# Altium project hand_main_v2.PrjPcb (part 1 of 2)
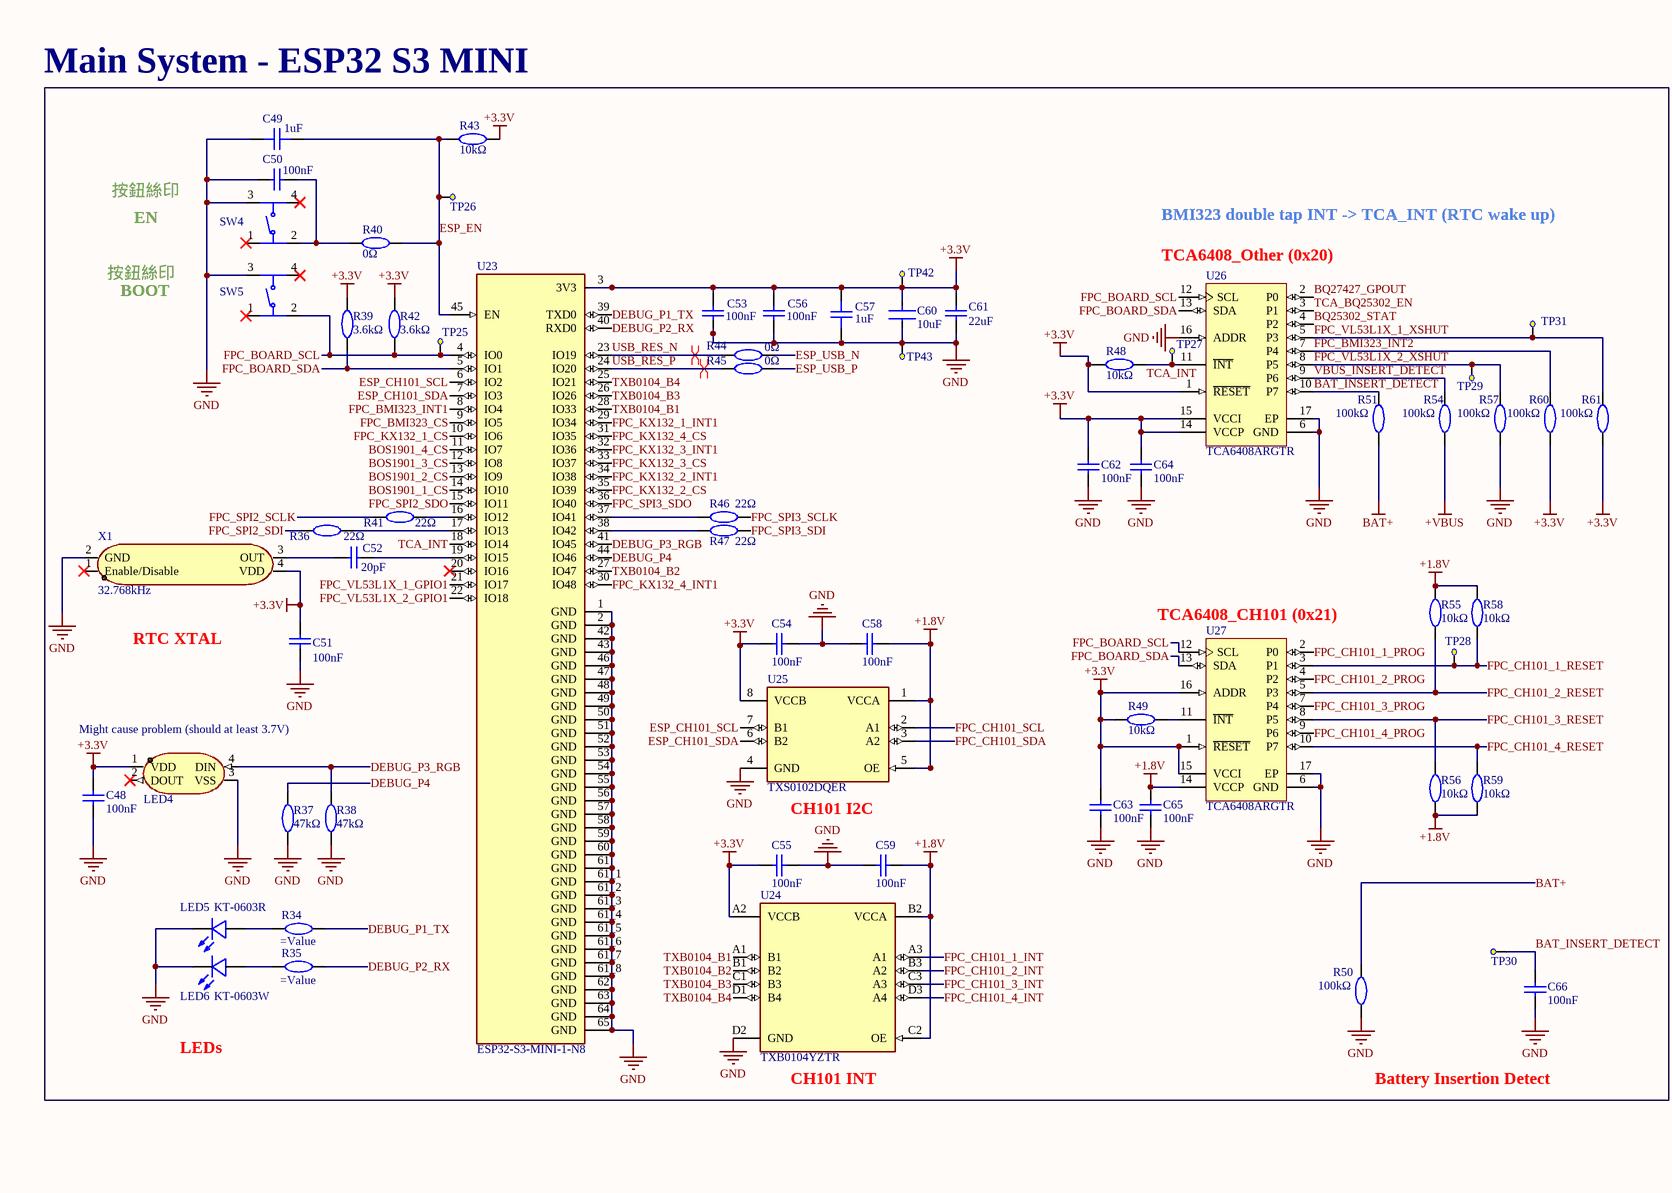
[diagram p0: hand_main_v2.SchDoc, left]
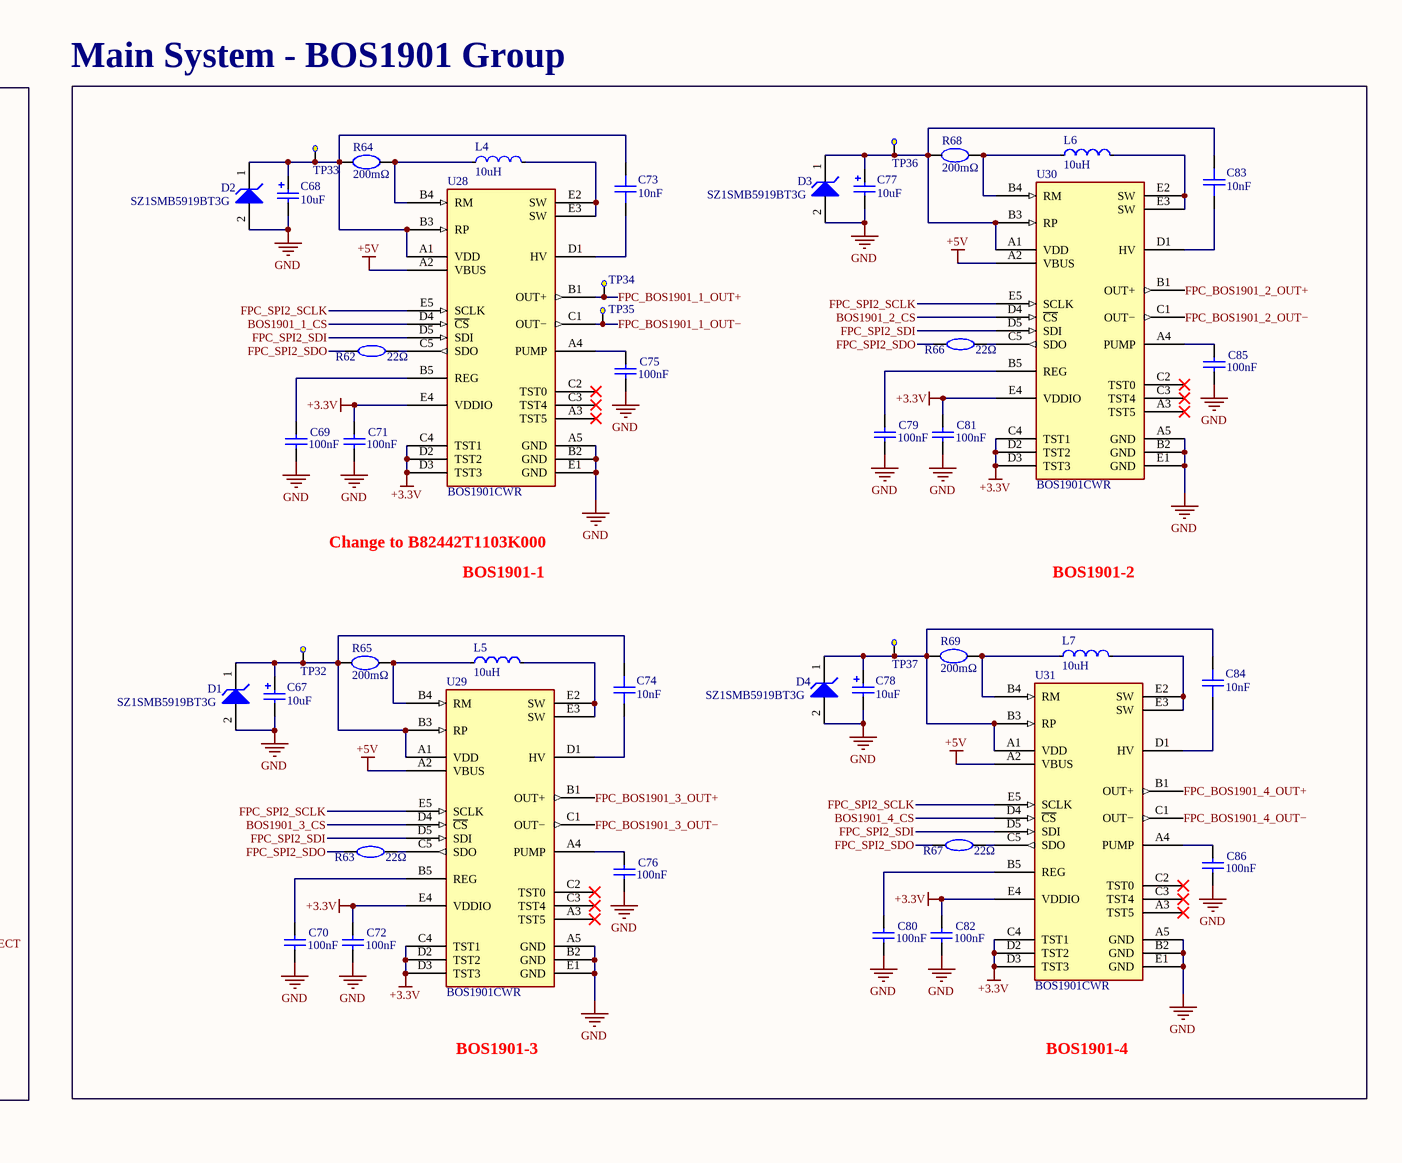
[diagram p1: hand_main_v2.SchDoc, middle]
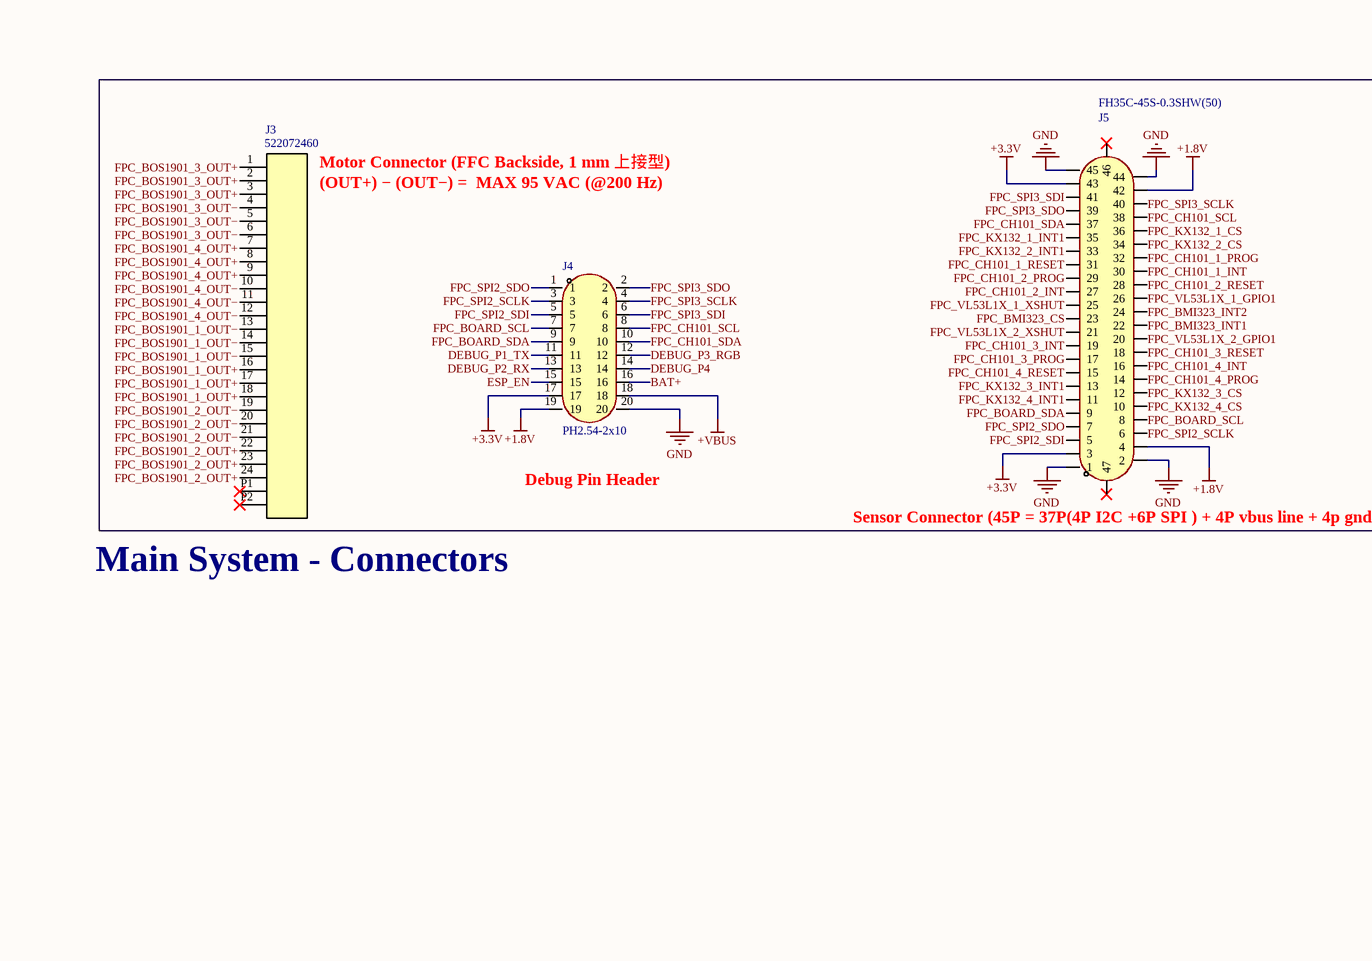
[diagram p2: hand_main_v2.SchDoc, right]
2 sheets, 213 parts. Net scope: global (net labels, ports and power ports of the same name join across sheets).
Board file: hand_main_board_v2.PcbDoc
Sheets:
  hand_main_v2.SchDoc
  hand_pdn_v2.SchDoc

## Sheet hand_main_v2.SchDoc
size 889 x 279 mm; SheetNumber: 1; SheetTotal: 2; SPICEModelCacheDEHSZJPB: <root> / <DocumentId>DEHSZJPB</DocumentId> / </root>

### Parts
C48  100nF  [CAPC1050X55X23NL05T13]
C49  1uF  [C0402]
C50  100nF  [CAPC1050X55X23NL05T13]
C51  100nF  [CAPC1050X55X23NL05T13]
C52  20pF  [C0603]
C53  100nF  [CAPC1050X55X23NL05T13]
C54  100nF  [CAPC1050X55X23NL05T13]
C55  100nF  [CAPC1050X55X23NL05T13]
C56  100nF  [CAPC1050X55X23NL05T13]
C57  1uF  [C0402]
C58  100nF  [CAPC1050X55X23NL05T13]
C59  100nF  [CAPC1050X55X23NL05T13]
C60  10uF  [FP-CL10-IPC_A]
C61  22uF  [CAPC2013X140X45ML15T25]
C62  100nF  [CAPC1050X55X23NL05T13]
C63  100nF  [CAPC1050X55X23NL05T13]
C64  100nF  [CAPC1050X55X23NL05T13]
C65  100nF  [CAPC1050X55X23NL05T13]
C66  100nF  [CAPC1050X55X23NL05T13]
C67  10uF  [CAP-SMD_L3.2-W1.6-RD-C7171]
C68  10uF  [CAP-SMD_L3.2-W1.6-RD-C7171]
C69  100nF  [CAPC1050X55X23NL05T13]
C70  100nF  [CAPC1050X55X23NL05T13]
C71  100nF  [CAPC1050X55X23NL05T13]
C72  100nF  [CAPC1050X55X23NL05T13]
C73  10nF  [C1206]
C74  10nF  [C1206]
C75  100nF  [CAPC1050X55X23NL05T13]
C76  100nF  [CAPC1050X55X23NL05T13]
C77  10uF  [CAP-SMD_L3.2-W1.6-RD-C7171]
C78  10uF  [CAP-SMD_L3.2-W1.6-RD-C7171]
C79  100nF  [CAPC1050X55X23NL05T13]
C80  100nF  [CAPC1050X55X23NL05T13]
C81  100nF  [CAPC1050X55X23NL05T13]
C82  100nF  [CAPC1050X55X23NL05T13]
C83  10nF  [C1206]
C84  10nF  [C1206]
C85  100nF  [CAPC1050X55X23NL05T13]
C86  100nF  [CAPC1050X55X23NL05T13]
D1  SZ1SMB5919BT3G  [ONSC-SMB-2-403A-03_H_V]
D2  SZ1SMB5919BT3G  [ONSC-SMB-2-403A-03_H_V]
D3  SZ1SMB5919BT3G  [ONSC-SMB-2-403A-03_H_V]
D4  SZ1SMB5919BT3G  [ONSC-SMB-2-403A-03_H_V]
J3  522072460  [CON_522072460_MOL]
J4  PH2.54-2x10  [HDR-TH_20P-P2.54-V-M-R2-C10-S2.54]
J5  FH35C-45S-0.3SHW(50)  [FPC-SMD_FH35C-45S-0.3SHW-50]
L4  10uH  [IND-SMD_L7.8-W7.0-A]
L5  10uH  [IND-SMD_L7.8-W7.0-A]
L6  10uH  [IND-SMD_L7.8-W7.0-A]
L7  10uH  [IND-SMD_L7.8-W7.0-A]
LED4  WS2812B-MINI-V3/W  [LED-SMD_4P-L3.5-W3.5-TL_WS2812B]  (value not drawn)
LED5  KT-0603R  [LED0603-RD]
LED6  KT-0603W  [LED0603-R-RD_WHITE]
R34  (no value)  [R0402]
R35  (no value)  [R0402]
R36  22Ω  [R0402]
R37  47kΩ  [R0402]
R38  47kΩ  [R0402]
R39  3.6kΩ  [R0603]
R40  0Ω  [R0402]
R41  22Ω  [R0402]
R42  3.6kΩ  [R0603]
R43  10kΩ  [R0402]
R44  0Ω  [R0402]
R45  0Ω  [R0402]
R46  22Ω  [R0402]
R47  22Ω  [R0402]
R48  10kΩ  [R0402]
R49  10kΩ  [R0402]
R50  100kΩ  [R0402]
R51  100kΩ  [R0402]
R54  100kΩ  [R0402]
R55  10kΩ  [R0402]
R56  10kΩ  [R0402]
R57  100kΩ  [R0402]
R58  10kΩ  [R0402]
R59  10kΩ  [R0402]
R60  100kΩ  [R0402]
R61  100kΩ  [R0402]
R62  22Ω  [R0402]
R63  22Ω  [R0402]
R64  200mΩ  [R1206]
R65  200mΩ  [R1206]
R66  22Ω  [R0402]
R67  22Ω  [R0402]
R68  200mΩ  [R1206]
R69  200mΩ  [R1206]
SW4  TS-1187A-B-A-B  [SW-SMD_4P-L5.1-W5.1-P3.70-LS6.5-TL-2]  (value not drawn)
SW5  TS-1187A-B-A-B  [SW-SMD_4P-L5.1-W5.1-P3.70-LS6.5-TL-2]  (value not drawn)
TP25  Test point  [Test_Point]  (value not drawn)
TP26  Test point  [Test_Point]  (value not drawn)
TP27  Test point  [Test_Point]  (value not drawn)
TP28  Test point  [Test_Point]  (value not drawn)
TP29  Test point  [Test_Point]  (value not drawn)
TP30  Test point  [Test_Point]  (value not drawn)
TP31  Test point  [Test_Point]  (value not drawn)
TP32  Test point  [Test_Point]  (value not drawn)
TP33  Test point  [Test_Point]  (value not drawn)
TP34  Test point  [Test_Point]  (value not drawn)
TP35  Test point  [Test_Point]  (value not drawn)
TP36  Test point  [Test_Point]  (value not drawn)
TP37  Test point  [Test_Point]  (value not drawn)
TP42  Test point  [Test_Point]  (value not drawn)
TP43  Test point  [Test_Point]  (value not drawn)
U23  ESP32-S3-MINI-1-N8  [XCVR_ESP32-S3-MINI-1-N8]
U24  TXB0104YZTR  [FP-YZT0012-IPC_B]
U25  TXS0102DQER  [FP-DQE0008A-IPC_C]
U26  TCA6408ARGTR  [RGT0016A_V]
U27  TCA6408ARGTR  [RGT0016A_V]
U28  BOS1901CWR  [BOS1901_BGA25C40P5X5_212X224X66]
U29  BOS1901CWR  [BOS1901_BGA25C40P5X5_212X224X66]
U30  BOS1901CWR  [BOS1901_BGA25C40P5X5_212X224X66]
U31  BOS1901CWR  [BOS1901_BGA25C40P5X5_212X224X66]
X1  32.768kHz  [OSC-SMD_4P-L2.5-W2.0-BL]

### Blocks framed on the sheet
Main System - ESP32 S3 MINI: C48-C66 LED4-LED6 R34-R51 R54-R61 SW4 SW5 TP25-TP31 TP42 TP43 U23-U27 X1
Main System - BOS1901 Group: C67-C86 D1-D4 L4-L7 R62-R69 TP32-TP37 U28-U31

### Nets
+1.8V: C58.1 C59.1 C65.1 J4.19 J5.4 J5.42 R55.1 R56.2 R58.1 R59.2 U24.B2(VCCA) U24.C2(OE) U25.1(VCCA) U25.5(OE) U27.14(VCCP)
+3.3V: C48.2 C51.2 C53.2 C54.2 C55.2 C56.2 C57.2 C60.1 C61.2 C62.1 C63.1 C64.1 C71.2 C72.2 C81.2 C82.2 J4.17 J5.3 J5.43 LED4.1(VDD) R39.2 R42.2 R43.1 R48.2 R49.2 R60.1 R61.1 TP42.TP?(Test_point) U23.3(3V3) U24.A2(VCCB) U25.8(VCCB) U26.1(~{RESET}) U26.14(VCCP) U26.15(VCCI) U27.1(~{RESET}) U27.15(VCCI) U27.16(ADDR) U28.C4(TST1) U28.D2(TST2) U28.D3(TST3) U28.E4(VDDIO) U29.C4(TST1) U29.D2(TST2) U29.D3(TST3) U29.E4(VDDIO) U30.C4(TST1) U30.D2(TST2) U30.D3(TST3) U30.E4(VDDIO) U31.C4(TST1) U31.D2(TST2) U31.D3(TST3) U31.E4(VDDIO) X1.4(VDD)
+5V: U28.A2(VBUS) U29.A2(VBUS) U30.A2(VBUS) U31.A2(VBUS)
+VBUS: J4.18 R54.1
BAT+: J4.16 R50.2 R51.1
GND: C48.1 C49.2 C50.2 C51.1 C53.1 C54.1 C55.1 C56.1 C57.1 C58.2 C59.2 C60.2 C61.1 C62.2 C63.2 C64.2 C65.2 C66.1 C67.2 C68.2 C69.1 C70.1 C71.1 C72.1 C75.1 C76.1 C77.2 C78.2 C79.1 C80.1 C81.1 C82.1 C85.1 C86.1 D1.2(A) D2.2(A) D3.2(A) D4.2(A) J4.20 J5.1 J5.2 J5.44 J5.45 LED4.3(VSS) LED5.1(K) LED6.2(K) R37.1 R38.1 R50.1 R57.1 SW4.3(C) SW5.3(C) TP43.TP?(Test_point) U23.1(GND) U23.2(GND) U23.42(GND) U23.43(GND) U23.46(GND) U23.47(GND) U23.48(GND) U23.49(GND) U23.50(GND) U23.51(GND) U23.52(GND) U23.53(GND) U23.54(GND) U23.55(GND) U23.56(GND) U23.57(GND) U23.58(GND) U23.59(GND) U23.60(GND) U23.61(GND) U23.61_1(GND) U23.61_2(GND) U23.61_3(GND) U23.61_4(GND) U23.61_5(GND) U23.61_6(GND) U23.61_7(GND) U23.61_8(GND) U23.62(GND) U23.63(GND) U23.64(GND) U23.65(GND) U24.D2(GND) U25.4(GND) U26.6(GND) U26.16(ADDR) U26.17(EP) U27.6(GND) U27.17(EP) U28.A5(GND) U28.B2(GND) U28.E1(GND) U29.A5(GND) U29.B2(GND) U29.E1(GND) U30.A5(GND) U30.B2(GND) U30.E1(GND) U31.A5(GND) U31.B2(GND) U31.E1(GND) X1.2(GND)
BAT_INSERT_DETECT: C66.2 R51.2 TP30.TP?(Test_point) U26.10(P7)
BOS1901_1_CS: U23.14(IO10) U28.D4(~{CS})
BOS1901_2_CS: U23.13(IO9) U30.D4(~{CS})
BOS1901_3_CS: U23.12(IO8) U29.D4(~{CS})
BOS1901_4_CS: U23.11(IO7) U31.D4(~{CS})
BQ25302_STAT: U26.4(P2)
BQ27427_GPOUT: U26.2(P0)
DEBUG_P1_TX: J4.11 R34.1 U23.39(TXD0)
DEBUG_P2_RX: J4.13 R35.1 U23.40(RXD0)
DEBUG_P3_RGB: J4.12 LED4.4(DIN) R38.2 U23.41(IO45)
DEBUG_P4: J4.14 R37.2 U23.44(IO46)
ESP_CH101_SCL: U23.6(IO2) U25.7(B1)
ESP_CH101_SDA: U23.7(IO3) U25.6(B2)
ESP_EN: C49.1 J4.15 R40.2 R43.2 TP26.TP?(Test_point) U23.45(EN)
ESP_USB_N: R44.2
ESP_USB_P: R45.2
FPC_BMI323_CS: J5.23 U23.9(IO5)
FPC_BMI323_INT1: J5.22 U23.8(IO4)
FPC_BMI323_INT2: J5.24 R60.2 U26.7(P4)
FPC_BOARD_SCL: J4.7 J5.8 R42.1 SW5.2(B) TP25.TP?(Test_point) U23.4(IO0) U26.12(SCL) U27.12(SCL)
FPC_BOARD_SDA: J4.9 J5.9 R39.1 U23.5(IO1) U26.13(SDA) U27.13(SDA)
FPC_BOS1901_1_OUT+: J3.16 J3.17 J3.18 TP34.TP?(Test_point) U28.B1(OUT+)
FPC_BOS1901_1_OUT−: J3.13 J3.14 J3.15 TP35.TP?(Test_point) U28.C1(OUT−)
FPC_BOS1901_2_OUT+: J3.22 J3.23 J3.24 U30.B1(OUT+)
FPC_BOS1901_2_OUT−: J3.19 J3.20 J3.21 U30.C1(OUT−)
FPC_BOS1901_3_OUT+: J3.1 J3.2 J3.3 U29.B1(OUT+)
FPC_BOS1901_3_OUT−: J3.4 J3.5 J3.6 U29.C1(OUT−)
FPC_BOS1901_4_OUT+: J3.7 J3.8 J3.9 U31.B1(OUT+)
FPC_BOS1901_4_OUT−: J3.10 J3.11 J3.12 U31.C1(OUT−)
FPC_CH101_1_INT: J5.30 U24.A3(A1)
FPC_CH101_1_PROG: J5.32 U27.2(P0)
FPC_CH101_1_RESET: J5.31 R58.2 TP28.TP?(Test_point) U27.3(P1)
FPC_CH101_2_INT: J5.27 U24.B3(A2)
FPC_CH101_2_PROG: J5.29 U27.4(P2)
FPC_CH101_2_RESET: J5.28 R55.2 U27.5(P3)
FPC_CH101_3_INT: J5.19 U24.C3(A3)
FPC_CH101_3_PROG: J5.17 U27.7(P4)
FPC_CH101_3_RESET: J5.18 R56.1 U27.8(P5)
FPC_CH101_4_INT: J5.16 U24.D3(A4)
FPC_CH101_4_PROG: J5.14 U27.9(P6)
FPC_CH101_4_RESET: J5.15 R59.1 U27.10(P7)
FPC_CH101_SCL: J4.8 J5.38 U25.2(A1)
FPC_CH101_SDA: J4.10 J5.37 U25.3(A2)
FPC_KX132_1_CS: J5.36 U23.10(IO6)
FPC_KX132_1_INT1: J5.35 U23.29(IO34)
FPC_KX132_2_CS: J5.34 U23.35(IO39)
FPC_KX132_2_INT1: J5.33 U23.34(IO38)
FPC_KX132_3_CS: J5.12 U23.33(IO37)
FPC_KX132_3_INT1: J5.13 U23.32(IO36)
FPC_KX132_4_CS: J5.10 U23.31(IO35)
FPC_KX132_4_INT1: J5.11 U23.30(IO48)
FPC_SPI2_SCLK: J4.3 J5.6 R41.1 U28.E5(SCLK) U29.E5(SCLK) U30.E5(SCLK) U31.E5(SCLK)
FPC_SPI2_SDI: J4.5 J5.5 R36.1 U28.D5(SDI) U29.D5(SDI) U30.D5(SDI) U31.D5(SDI)
FPC_SPI2_SDO: J4.1 J5.7 R62.1 R63.1 R66.1 R67.1 U23.15(IO11)
FPC_SPI3_SCLK: J4.4 J5.40 R46.2
FPC_SPI3_SDI: J4.6 J5.41 R47.2
FPC_SPI3_SDO: J4.2 J5.39 U23.36(IO40)
FPC_VL53L1X_1_GPIO1: J5.26 U23.21(IO17)
FPC_VL53L1X_1_XSHUT: J5.25 R61.2 TP31.TP?(Test_point) U26.5(P3)
FPC_VL53L1X_2_GPIO1: J5.20 U23.22(IO18)
FPC_VL53L1X_2_XSHUT: J5.21 R57.2 TP29.TP?(Test_point) U26.8(P5)
TCA_BQ25302_EN: U26.3(P1)
TCA_INT: R48.1 TP27.TP?(Test_point) U23.18(IO14) U26.11(~{INT})
TXB0104_B1: U23.28(IO33) U24.A1(B1)
TXB0104_B2: U23.27(IO47) U24.B1(B2)
TXB0104_B3: U23.26(IO26) U24.C1(B3)
TXB0104_B4: U23.25(IO21) U24.D1(B4)
USB_RES_N: R44.1 U23.23(IO19)
USB_RES_P: R45.1 U23.24(IO20)
VBUS_INSERT_DETECT: R54.2 U26.9(P6)
NetC50_1: C50.1 R40.1 SW4.2(B)
NetC52_1: C52.1 X1.3(OUT)
NetC52_2: C52.2 U23.19(IO15)
NetC67_1: C67.1 C74.2 D1.1(K) R65.1 TP32.TP?(Test_point) U29.A1(VDD) U29.B3(RP)
NetC68_1: C68.1 C73.2 D2.1(K) R64.1 TP33.TP?(Test_point) U28.A1(VDD) U28.B3(RP)
NetC69_2: C69.2 U28.B5(REG)
NetC70_2: C70.2 U29.B5(REG)
NetC73_1: C73.1 U28.D1(HV)
NetC74_1: C74.1 U29.D1(HV)
NetC75_2: C75.2 U28.A4(PUMP)
NetC76_2: C76.2 U29.A4(PUMP)
NetC77_1: C77.1 C83.2 D3.1(K) R68.1 TP36.TP?(Test_point) U30.A1(VDD) U30.B3(RP)
NetC78_1: C78.1 C84.2 D4.1(K) R69.1 TP37.TP?(Test_point) U31.A1(VDD) U31.B3(RP)
NetC79_2: C79.2 U30.B5(REG)
NetC80_2: C80.2 U31.B5(REG)
NetC83_1: C83.1 U30.D1(HV)
NetC84_1: C84.1 U31.D1(HV)
NetC85_2: C85.2 U30.A4(PUMP)
NetC86_2: C86.2 U31.A4(PUMP)
NetL4_1: L4.1 R64.2 U28.B4(RM)
NetL4_2: L4.2 U28.E2(SW) U28.E3(SW)
NetL5_1: L5.1 R65.2 U29.B4(RM)
NetL5_2: L5.2 U29.E2(SW) U29.E3(SW)
NetL6_1: L6.1 R68.2 U30.B4(RM)
NetL6_2: L6.2 U30.E2(SW) U30.E3(SW)
NetL7_1: L7.1 R69.2 U31.B4(RM)
NetL7_2: L7.2 U31.E2(SW) U31.E3(SW)
NetLED5_2: LED5.2(A) R34.2
NetLED6_1: LED6.1(A) R35.2
NetR36_2: R36.2 U23.17(IO13)
NetR41_2: R41.2 U23.16(IO12)
NetR46_1: R46.1 U23.37(IO41)
NetR47_1: R47.1 U23.38(IO42)
NetR49_1: R49.1 U27.11(~{INT})
NetR62_2: R62.2 U28.C5(SDO)
NetR63_2: R63.2 U29.C5(SDO)
NetR66_2: R66.2 U30.C5(SDO)
NetR67_2: R67.2 U31.C5(SDO)

Not connected (* = marked no-connect by the designer): J3 P1* P2*; J5 46* 47*; LED4 2(DOUT)*; SW4 1(A)* 4(D)*; SW5 1(A)* 4(D)*; U23 20(IO16)*; U28 A3(TST5)* C2(TST0)* C3(TST4)*; U29 A3(TST5)* C2(TST0)* C3(TST4)*; U30 A3(TST5)* C2(TST0)* C3(TST4)*; U31 A3(TST5)* C2(TST0)* C3(TST4)*; X1 1(Enable/Disable)*

### Layout directives
differential pair: USB_RES_N, USB_RES_P

### Notes on the sheet
- 按鈕絲印
- EN
- BMI323 double tap INT -> TCA_INT (RTC wake up)
- (near U26) TCA6408_Other (0x20)
- BOOT
- (near J3) Motor Connector (FFC Backside, 1 mm 上接型)
- (near J3) (OUT+) − (OUT−) =  MAX 95 VAC (@200 Hz)
- Change to B82442T1103K000
- (near U27) TCA6408_CH101 (0x21)
- BOS1901-1
- BOS1901-2
- RTC XTAL
- (near LED4) Might cause problem (should at least 3.7V)
- Debug Pin Header
- CH101 I2C
- (near J5) Sensor Connector (45P = 37P(4P I2C +6P SPI ) + 4P vbus line + 4p gnd)
- (near J3) Main System - Connectors
- LEDs
- (near U24) CH101 INT
- Battery Insertion Detect
- BOS1901-3
- BOS1901-4

### Library data of the parts
C48 C50 C51 C53-C56 C58 C59 C62-C66 C69-C72 C75 C76 C79-C82 C85 C86 = CL05B104KO5NNNC: Chip Capacitor, 100 nF, +/- 10%, 16 V, -55 to 125 degC, 0402 (1005 Metric), RoHS, Tape and Reel; Manufacturer: Samsung Electro-Mechanics; Capacitance: 100000pF; Dielectric: X7R; Rated Voltage: 16V; Case Size/Dimension: 0402; Tolerance (%): ±10%; Manufacturer URL: http://www.samsungsem.com/global/index.jsp; Datasheet URL: https://datasheet.ciiva.com/29198/458718-da-01-en-vs-kondensator-0402-29198423.pdf; Datasheet Version: Nov-10
C49 C57 = CL05A105KA5NQNC: MLCC, 1 uF, 25 V, ± 10%, X5R, 0402 [1005 Metric]; Manufacturer: SAMSUNG(三星); Add into BOM: yes; Voltage Rated: 25V; Symbol: CL05A105KA5NQNC; Device: CL05A105KA5NQNC; LCSC Part Name: 1uF ±10% 25V; Supplier Part: C52923; Manufacturer Part: CL05A105KA5NQNC; Supplier Footprint: 0402; JLCPCB Part Class: Basic Part; Datasheet: https://atta.szlcsc.com/upload/public/pdf/source/20160218/1457707763339.pdf; Supplier: LCSC; Convert to PCB: yes; Value: 1uF; Tolerance: ±10%; Temperature Coefficient: X5R; Name: 1uF
C52 = CL10C200JB8NNNC: MLCC, 20pF, 50 V, ± 5%, C0G, 0603 [1608 Metric]; Manufacturer: SAMSUNG(三星); Add into BOM: yes; Voltage Rated: 50V; Symbol: CL10C200JB8NNNC; Device: CL10C200JB8NNNC; LCSC Part Name: 20pF ±5% 50V; Supplier Part: C1648; Manufacturer Part: CL10C200JB8NNNC; Supplier Footprint: 0603; JLCPCB Part Class: Basic Part; Datasheet: https://atta.szlcsc.com/upload/public/pdf/source/20160218/1457707763339.pdf; Supplier: LCSC; Convert to PCB: yes; Value: 20pF; Tolerance: ±5%; Temperature Coefficient: C0G; Name: 20pF
C60 = CL10A106MA8NRNC: Cap Ceramic 10uF 25V X5R ±20% Pad SMD 0603 +85°C T/R; Width: 0.031inch; Voltage Rating: 25V; Length: 0.063inch; Case Code (Metric): 1608; Dielectric: X5R; Termination: Wraparound; Capacitance: 10uF; Lead Free: Lead Free; Mount: Surface Mount; Package Quantity: 1; Case Code (Imperial): 0603; Thickness: 0.035inch; Packaging: Tape and Reel; Contact Plating: Tin; Min Operating Temperature: -55°C; Tolerance: 20%; Max Operating Temperature: 85°C; Case/Package: 0603
C61 = CL21A226MAQNNNE: Multi-layer Ceramic Capacitor, 22 uF, -55 to 85 degC, 2-Pin SMD (0805), RoHS, Tape and Reel; Manufacturer: Samsung Electro-Mechanics; Voltage - Rated: 25V; Other Names: 1276-2908-2; Capacitance: 22µF; Featured Product: Multi-LayerCeramicCapacitors; Product Training Modules: HighCapMLCCFamily; Temperature Coefficient: X5R; Tolerance: ±20%; Online Catalog: CLSeries,HighCapacitance; Applications: GeneralPurpose; RoHS Information: MLCCRoHS2Compliance; Height - Seated (Max): -; Lead Style: -; Lead Spacing: -; Datasheet URL: http://datasheet.octopart.com/CL21A226MAQNNNE-Samsung-datasheet-48647558.pdf; Size / Dimension: 0.079"Lx0.049"W(2.00mmx1.25mm); Thickness (Max): 0.055"(1.40mm); Family: CeramicCapacitors; Package Description: 2-Pin Surface Mount Device, Body 2.0 x 1.25 mm; Datasheet Version: 07/2015; Packaging: Tape&Reel(TR); Manufacturer URL: http://www.samsungsem.com/global/index.jsp; Ratings: -; Package / Case: 0805(2012Metric); Standard Package: 2,000; Mounting Type: SurfaceMount,MLCC; Mounting Technology: SurfaceMount; Category: Capacitors; Package Reference: 0805; Series: CL; Features: -; Operating Temperature: -55°C~85°C
C67 C68 C77 C78 = TAJA106K016RNJ: 10 uF Tantalum Capacitor, Operating Temperature: -55°C to +125°C, ESR: 3Ω @ 100kHz, Tolerance: ±10%, Rated Voltage: 16V.; Manufacturer: Kyocera AVX; Add into BOM: yes; Rated Voltage: 16V; Symbol: TAJA106K016RNJ; Device: TAJA106K016RNJ; LCSC Part Name: 10uF ±10% 16V; Supplier Part: C7171; Manufacturer Part: TAJA106K016RNJ; Supplier Footprint: CASE-A-3216; JLCPCB Part Class: 基础库; Datasheet: https://atta.szlcsc.com/upload/public/pdf/source/20160107/1457707750344.pdf; Supplier: LCSC; Convert to PCB: yes; Value: 10uF; Tolerance: ±10%; Equivalent Series Resistance(ESR): 3Ω@100kHz; Operating Temperature: -55℃~+125℃; Name: 10uF
C73 C74 C83 C84 = GCM31B5C2E103JX01L: Cap Ceramic 0.01uF 250V C0G 5% SMD 1206 125°C Embossed T/R; Manufacturer: muRata(村田); Add into BOM: yes; Symbol: GCM31B5C2E103JX01L; Device: GCM31B5C2E103JX01L; LCSC Part Name: 10nF ±5% 250V; Supplier Part: C1021645; Manufacturer Part: GCM31B5C2E103JX01L; Supplier Footprint: 1206; JLCPCB Part Class: 扩展库; Datasheet: https://atta.szlcsc.com/upload/public/pdf/source/20200305/C490387_23319AE8C154DEB24C505E6C82A8106A.pdf; Supplier: LCSC; Convert to PCB: yes; Value: 10nF; Tolerance: ±5%; Voltage Rated: 250V; Temperature Coefficient: -; Name: 10nF
D1-D4 = SZ1SMB5919BT3G: 3 W Zener Voltage Regulator, 2-Pin SMB, Pb-Free, Tape and Reel; Manufacturer: On Semiconductor; VZ Typ (V): 5.6; RoHS: Pb-Free; ComponentLink1URL: http://www.onsemi.com/; PackageReference: SMB-2-403A-03_H; ComponentLink2Description: Datasheet; ComponentLink3Description: Package Specification; PackageDescription: 2-Pin Small Molded Package, J-Bend Lead, Body 4.33 x 3.625 mm; DatasheetVersion: Rev. 8; ComponentLink1Description: Manufacturer URL; PartNumber: SZ1SMB5919BT3G; ComponentLink3URL: http://www.onsemi.com/pub_link/Collateral/1SMB5913BT3-D.PDF; Packing: Tape and Reel; Mounting Technology: Surface Mount; ComponentLink2URL: http://www.onsemi.com/pub_link/Collateral/1SMB5913BT3-D.PDF; PackageVersion: Rev. H, 05/2011
J3 = 522072460: FFC 1mm 24P; Mfr_Name: Molex Connector Corporation; RefDes: RefDes; Type: Type
J4 = PH2.54-2x10: Pin Header 2.54mm, 2x10; Manufacturer: ZHOURI(洲日); Add into BOM: yes; Pin Structure: 2x10P; Symbol: PH2.54-2x10; Device: PH2.54-2x10; Supplier: LCSC; Supplier Part: C5116480; Manufacturer Part: PH2.54-2x10; JLCPCB Part Class: Extended Part; LCSC Part Name: PH2.54-2x10; Supplier Footprint: 插件,P=2.54mm; Datasheet: https://atta.szlcsc.com/upload/public/pdf/source/20220412/C6BEA3D643D1CE07163CD717B50927E0.pdf; Convert to PCB: yes; Pitch: 2.54mm; Number of Rows: 双排; Number of Pins: 20P; Name: PH2.54-2x10
J5 = FH35C-45S-0.3SHW(50): FPC Connector, 45P, 0.3mm, Right Angle, Double Side Connection; Manufacturer: HRS(广濑); Add into BOM: yes; Locking Feature: 翻盖式; FFC, FCB Thickness: 0.2mm; Symbol: FH35C-45S-0.3SHW(50); Device: FH35C-45S-0.3SHW(50); Supplier: LCSC; Supplier Part: C424664; Manufacturer Part: FH35C-45S-0.3SHW(50); JLCPCB Part Class: 扩展库; LCSC Part Name: 间距:0.3mm P数:45P 翻盖式 双侧触点/上下接; Supplier Footprint: SMD,P=0.3mm,卧贴; Datasheet: https://atta.szlcsc.com/upload/public/pdf/source/20190903/C424665_6B902B5D9FC6843B4690A059D72505C7.pdf; Convert to PCB: yes; Contact Type: 双侧触点/上下接; Number of Contacts: 45P; Pitch: 0.3mm; Mounting Type: 卧贴; Height Above Board: 0.88mm; Contact Material: 磷青铜; Contact Plating: 金; Operating Temperature Range: -55℃~+85℃; Name: FH35C-45S-0.3SHW(50)
L4-L7 = CD75T125NP-100KC: Ind Power Unshielded Wirewound 10uH 10% 2.52MHz 2.3A Carrier T/R; Manufacturer: Sumida(胜美达); Add into BOM: yes; Rated Current: 2.8A; DC Resistance (DCR): 70mΩ; Symbol: CD75T125NP-100KC; Device: CD75T125NP-100KC; Supplier: LCSC; Supplier Part: C171577; Manufacturer Part: CD75T125NP-100KC; Value: 10uH; JLCPCB Part Class: 扩展库; LCSC Part Name: 10uH ±10% 2.8A; Supplier Footprint: SMD,7x7.8mm; Datasheet: https://atta.szlcsc.com/upload/public/pdf/source/20180612/C171578_76546A41B009E6D637AB9F25A289E360.pdf; Convert to PCB: yes; Tolerance: ±10%; Saturation Current (Isat): 2.8A; Ratings: AEC-Q200; Name: 10uH
LED4 = WS2812B-MINI-V3/W: Main wavelength: 472nm, Main wavelength: 518nm, Main wavelength: 622nm, Emission color: RGB (Red, Green, Blue), Forward voltage (VF): 5V, Forward current: 12mA; Manufacturer: worldsemi; Add into BOM: yes; Emitted Color: RGB三色; Dominant Wavelength: 472nm；518nm；622nm; Symbol: WS2812B-MINI; Device: WS2812B-MINI-V3/W; LCSC Part Name: RGB三色; Supplier Part: C527089; Manufacturer Part: WS2812B-MINI-V3/W; Supplier Footprint: SMD3535; JLCPCB Part Class: 扩展库; Datasheet: https://atta.szlcsc.com/upload/public/pdf/source/20190620/C114583_ECCAEB884D1CBA01F5696FFC90F90D84.pdf; Supplier: LCSC; Convert to PCB: yes; Power Dissipation: -; Forward Current: 12mA; Peak Wavelength: -; Diode Configuration: -; Lens Color: -; Color Temperature: -; Viewing Angle: -; Mounting Sytle: -; Operating Temperature: -; Name: WS2812B-MINI-V3/W
LED5 = KT-0603R: LED, Red 0603; Manufacturer: KENTO; Add into BOM: yes; Emitted Color: 红色; Symbol: KT-0603R; Device: KT-0603R; LCSC Part Name: 0603 红灯 高亮; Supplier Part: C2286; Manufacturer Part: KT-0603R; Supplier Footprint: 0603; JLCPCB Part Class: 基础库; Datasheet: https://atta.szlcsc.com/upload/public/pdf/source/20160616/1466072038404.pdf; Supplier: LCSC; Convert to PCB: yes; Power Dissipation: -; Forward Current: -; Dominant Wavelength: -; Peak Wavelength: -; Diode Configuration: -; Lens Color: -; Color Temperature: -; Viewing Angle: -; Mounting Sytle: -; Operating Temperature: -40℃~+85℃; Name: KT-0603R
LED6 = KT-0603W: LED, White 0603; Manufacturer: KENTO; Symbol: 0603White light_C2290; Add into BOM: yes; Emitted Color: 白色; Device: KT-0603W; LCSC Part Name: 0603 白灯 高亮; Supplier Part: C2290; Manufacturer Part: KT-0603W; Supplier Footprint: 0603; JLCPCB Part Class: 基础库; Datasheet: https://atta.szlcsc.com/upload/public/pdf/source/20221101/4C23D5C85BA051E44A00B833D0A41468.pdf; Supplier: LCSC; Convert to PCB: yes; Name: KT-0603W
R34 R35 = 0402WGF1001TCE: Resistor, Res Thick Film 0402 1K Ohm 1% 0.063W(1/16W) ±100ppm/°C Pad SMD T/R; Manufacturer: UNI-ROYAL(厚声); Value: 1kΩ; Add into BOM: yes; Power(Watts): 62.5mW; Overload Voltage (Max): 50V; Temperature Coefficient: ±100ppm/℃; Symbol: 0402WGF1001TCE; Device: 0402WGF1001TCE; Supplier: LCSC; Manufacturer Part: 0402WGF1001TCE; Supplier Part: C11702; JLCPCB Part Class: 基础库; LCSC Part Name: 1kΩ ±1% 62.5mW 厚膜电阻; Supplier Footprint: 0402; Datasheet: https://atta.szlcsc.com/upload/public/pdf/source/20200306/C422600_1E6D84923E4A46A82E41ADD87F860B5C.pdf; Convert to PCB: yes; Type: 厚膜电阻; Tolerance: ±1%; Operating Temperature Range: -55℃~+155℃; Name: =Value; Resistance: 1kΩ
R36 R41 R46 R47 R62 R63 R66 R67 = 0402WGF220JTCE: Resistor, Res Thick Film 0402 22 Ohm 1% 0.063W(1/16W) ±200ppm/°C Pad SMD T/R; Manufacturer: UNI-ROYAL(厚声); Add into BOM: yes; Power(Watts): 62.5mW; Overload Voltage (Max): 50V; Temperature Coefficient: ±100ppm/℃; Symbol: 0402WGF220JTCE; Device: 0402WGF220JTCE; Supplier: LCSC; Manufacturer Part: 0402WGF220JTCE; Supplier Part: C25092; Value: 22Ω; JLCPCB Part Class: Basic Part; LCSC Part Name: 22Ω ±1% 62.5mW 厚膜电阻; Supplier Footprint: 0402; Datasheet: https://atta.szlcsc.com/upload/public/pdf/source/20200306/C422600_1E6D84923E4A46A82E41ADD87F860B5C.pdf; Convert to PCB: yes; Type: 厚膜电阻; Tolerance: ±1%; Operating Temperature Range: -55℃~+155℃; Name: 22Ω
R37 R38 = 0402WGF4702TCE: Resistor, Res Thick Film 0402 47K Ohm 1% 0.063W(1/16W) ±100ppm/°C Pad SMD T/R; Manufacturer: UNI-ROYAL(厚声); Add into BOM: yes; Power(Watts): 62.5mW; Overload Voltage (Max): 50V; Temperature Coefficient: ±100ppm/℃; Symbol: 0402WGF4702TCE; Device: 0402WGF4702TCE; Supplier: LCSC; Manufacturer Part: 0402WGF4702TCE; Supplier Part: C25792; Value: 47kΩ; JLCPCB Part Class: 基础库; LCSC Part Name: 47kΩ ±1% 62.5mW 厚膜电阻; Supplier Footprint: 0402; Datasheet: https://atta.szlcsc.com/upload/public/pdf/source/20200306/C422600_1E6D84923E4A46A82E41ADD87F860B5C.pdf; Convert to PCB: yes; Type: 厚膜电阻; Tolerance: ±1%; Operating Temperature Range: -55℃~+155℃; Name: 47kΩ
R39 R42 = 0603WAF3601T5E: Resistor, Res Thick Film 0603 3.6K Ohm 1% 0.1W ±100ppm/°C Pad SMD T/R; Manufacturer: UNI-ROYAL(厚声); Add into BOM: yes; Power(Watts): 100mW; Overload Voltage (Max): 75V; Temperature Coefficient: ±100ppm/℃; Symbol: 0603WAF3601T5E; Device: 0603WAF3601T5E; Supplier: LCSC; Manufacturer Part: 0603WAF3601T5E; Supplier Part: C22980; Value: 3.6kΩ; JLCPCB Part Class: Basic Part; LCSC Part Name: 3.6kΩ ±1% 100mW 厚膜电阻; Supplier Footprint: 0603; Datasheet: https://atta.szlcsc.com/upload/public/pdf/source/20200306/C422600_1E6D84923E4A46A82E41ADD87F860B5C.pdf; Convert to PCB: yes; Type: 厚膜电阻; Tolerance: ±1%; Operating Temperature Range: -55℃~+155℃; Name: 3.6kΩ
R40 R44 R45 = 0402WGF0000TCE: Resistor, Res Thick Film 0402 0 Ohm 1% 0.063W(1/16W) ±800ppm/°C Pad SMD T/R; Manufacturer: UNI-ROYAL(厚声); Add into BOM: yes; Power(Watts): 62.5mW; Overload Voltage (Max): 50V; Temperature Coefficient: ±800ppm/℃; Symbol: 0402WGF0000TCE; Device: 0402WGF0000TCE; Supplier: LCSC; Manufacturer Part: 0402WGF0000TCE; Supplier Part: C17168; Value: 0Ω; JLCPCB Part Class: 基础库; LCSC Part Name: 0Ω ±1% 62.5mW 厚膜电阻; Supplier Footprint: 0402; Datasheet: https://atta.szlcsc.com/upload/public/pdf/source/20200306/C422600_1E6D84923E4A46A82E41ADD87F860B5C.pdf; Convert to PCB: yes; Type: 厚膜电阻; Tolerance: ±1%; Operating Temperature Range: -55℃~+155℃; Name: 0Ω
R43 R48 R49 R55 R56 R58 R59 = 0402WGF1002TCE: Resistor, Res Thick Film 0402 10K Ohm 1% 0.063W(1/16W) ±100ppm/°C Pad SMD T/R; Manufacturer: UNI-ROYAL(厚声); Add into BOM: yes; Power(Watts): 62.5mW; Overload Voltage (Max): 50V; Temperature Coefficient: ±100ppm/℃; Symbol: 0402WGF1002TCE; Device: 0402WGF1002TCE; Supplier: LCSC; Manufacturer Part: 0402WGF1002TCE; Supplier Part: C25744; Value: 10kΩ; JLCPCB Part Class: 基础库; LCSC Part Name: 10kΩ ±1% 62.5mW 厚膜电阻; Supplier Footprint: 0402; Datasheet: https://atta.szlcsc.com/upload/public/pdf/source/20200306/C422600_1E6D84923E4A46A82E41ADD87F860B5C.pdf; Convert to PCB: yes; Type: 厚膜电阻; Tolerance: ±1%; Operating Temperature Range: -55℃~+155℃; Name: 10kΩ
R50 R51 R54 R57 R60 R61 = 0402WGF1003TCE: Resistor, Res Thick Film 0402 100K Ohm 1% 0.063W(1/16W) ±100ppm/°C Pad SMD T/R; Manufacturer: UNI-ROYAL(厚声); Add into BOM: yes; Power(Watts): 62.5mW; Overload Voltage (Max): 50V; Temperature Coefficient: ±100ppm/℃; Symbol: 0402WGF1003TCE; Device: 0402WGF1003TCE; Supplier: LCSC; Manufacturer Part: 0402WGF1003TCE; Supplier Part: C25741; Value: 100kΩ; JLCPCB Part Class: Basic Part; LCSC Part Name: 100kΩ ±1% 62.5mW 厚膜电阻; Supplier Footprint: 0402; Datasheet: https://atta.szlcsc.com/upload/public/pdf/source/20200306/C422600_1E6D84923E4A46A82E41ADD87F860B5C.pdf; Convert to PCB: yes; Type: 厚膜电阻; Tolerance: ±1%; Operating Temperature Range: -55℃~+155℃; Name: 100kΩ
R64 R65 R68 R69 = HoYH1206-1W-200mR-1%: Resistance: 0.2Ω Power: 1W, Mounting Type: Surface Mount, Resistor Type: Shunt Resistor, Precision: ±1%,.; Manufacturer: Milliohm(毫欧); Add into BOM: yes; Mounting Sytle: 贴片; Symbol: HOYH1206-1W-200MR-1%; Device: HoYH1206-1W-200mR-1%; Supplier: LCSC; Supplier Part: C2932839; Manufacturer Part: HoYH1206-1W-200mR-1%; Value: 200mΩ; JLCPCB Part Class: 扩展库; LCSC Part Name: 200mΩ ±1% 1W; Supplier Footprint: 1206; Datasheet: https://atta.szlcsc.com/upload/public/pdf/source/20211116/A510C0D8A660B2C11D153FDB54B68FB7.pdf; Convert to PCB: yes; Type: 采样电阻; Tolerance: ±1%; Power(Watts): 1W; Name: 200mΩ
SW4 = TS-1187A-B-A-B: Touch Button; Manufacturer: XKB Connectivity(中国星坤); Add into BOM: yes; Circuit: 单刀单掷; Actuator Style: 圆形按钮; Operating Force: 160gf; Switch Length: 5.1mm; Switch Height: 1.5mm; Strike Gundam: 不带; Contact Current: 50mA; Voltage Rating (DC): 12V; Actuator/Cap Color: 金色; With Lamp: 无; Mechanical Life: 10万次; Symbol: TS-1187A-B-A-B; Device: TS-1187A-B-A-B; Supplier: LCSC; Supplier Part: C318884; Manufacturer Part: TS-1187A-B-A-B; JLCPCB Part Class: 基础库; LCSC Part Name: 5.1*5.1*1.5mm 立贴 轻触开关; Supplier Footprint: SMD; Datasheet: https://atta.szlcsc.com/upload/public/pdf/source/20200227/C318890_053E50208A88A7BA1965D8746000774E.pdf; Convert to PCB: yes; Mounting Style: 立贴; Switch Width: 5.1mm; Insulation Resistance: -; Operating Temperature: -30℃~+85℃; Name: TS-1187A-B-A-B
SW5 = TS-1187A-B-A-B: Touch Button, Boot; Manufacturer: XKB Connectivity(中国星坤); Add into BOM: yes; Circuit: 单刀单掷; Actuator Style: 圆形按钮; Operating Force: 160gf; Switch Length: 5.1mm; Switch Height: 1.5mm; Strike Gundam: 不带; Contact Current: 50mA; Voltage Rating (DC): 12V; Actuator/Cap Color: 金色; With Lamp: 无; Mechanical Life: 10万次; Symbol: TS-1187A-B-A-B; Device: TS-1187A-B-A-B; Supplier: LCSC; Supplier Part: C318884; Manufacturer Part: TS-1187A-B-A-B; JLCPCB Part Class: 基础库; LCSC Part Name: 5.1*5.1*1.5mm 立贴 轻触开关; Supplier Footprint: SMD; Datasheet: https://atta.szlcsc.com/upload/public/pdf/source/20200227/C318890_053E50208A88A7BA1965D8746000774E.pdf; Convert to PCB: yes; Mounting Style: 立贴; Switch Width: 5.1mm; Insulation Resistance: -; Operating Temperature: -30℃~+85℃; Name: TS-1187A-B-A-B
TP25-TP37 TP42 TP43 = Test_Point: Value: Test point
U23 = ESP32-S3-MINI-1-N8: Bluetooth, WiFi 802.11b/g/n, Bluetooth v5.0 Transceiver Module 2.4GHz PCB Trace Surface Mount; MF: Espressif Systems; Package: None; Price: None; Check_prices: https://www.snapeda.com/parts/ESP32-S3-MINI-1-N8/Espressif+Systems/view-part/?ref=eda; Value: *; SnapEDA_Link: https://www.snapeda.com/parts/ESP32-S3-MINI-1-N8/Espressif+Systems/view-part/?ref=snap; MP: ESP32-S3-MINI-1-N8; Availability: In Stock; Purchase-URL: https://pricing.snapeda.com/search?q=ESP32-S3-MINI-1-N8&ref=eda
U24 = TXB0104YZTR: I2C Level Shifter 4 channel, IC TRNSLTR BIDIRECTIONAL 12DSBGA; Output Type: 3-STATE; High Level Output Current: -20uA; Low Level Output Current: 20uA; Max Supply Voltage: 5.5V; Number of Bits: 4; Min Supply Voltage: 1.2V; Logic Function: Translator; Propagation Delay: 31ns; Data Rate: 100Mbps; Quiescent Current: 3.5uA; Turn-On Delay Time: 7.4ns; Series: -; Contact Plating: Copper; Packaging: Tape and Reel; Case/Package: BGA; Min Operating Temperature: -40°C; Package Quantity: 1; Max Operating Temperature: 85°C; RoHS Compliant: Yes; Radiation Hardening: No; Mount: Surface Mount; REACH SVHC: No SVHC; Number of Channels: 4; Lead Free: Lead Free; Number of Pins: 12
U25 = TXS0102DQER: 2-Bit Bidirectional Voltage-Level Shifter for Open-Drain and Push-Pull Application 8-X2SON -40 to 85; Manufacturer: Texas Instruments; Min Supply Voltage: 1.65V; Number Of Outputs: 2; Propagation Delay: 28ns; Number Of Circuits: 1; V A Min: 1.25V; V A Max: 3.6V; Standoff Height: 0mm; V B Min: 2.3V; Max Supply Voltage: 5.5V; Max Junction Temp: +150°C; Logic Function Desc: Non-Inverting; Data Rate: 24Mbits/s; Nominal Supply Current: 14.4uA; Device Class L1: Integrated Circuits (ICs); Temperature Range Low: -40°C; Ipc Land Pattern Name: DFN140X100X37-8; RoHS: TRUE; Package: DQE0008A; Automotive: No; Digikey Description: IC TRNSLTR BIDIRECTIONAL 8X2SON; Device Class L3: Voltage Level Shifters; Octopart: https://octopart.com/txs0102dqer-texas+instruments-19973770; ComponentLink2URL: http://www.ti.com/lit/ds/symlink/txs0102.pdf; Number Of Inputs: 2; Height: 0.4mm; ComponentLink2Description: Datasheet; Ambient Temperature Range Low: -40°C; Ambient Temperature Range High: +85°C; Temperature Range High: +85°C; Mouser Description: Translation - Voltage Levels 2B Bidirec Vltg-Lev Translator; Temperature: -40°C to +85°C; Lead Free: Yes; Device Class L2: Logic ICs; Category: IC; Manufacturer Part Number: TXS0102DQER; V B Max: 5.5V
U26 U27 = TCA6408ARGTR: Low-Voltage 8-Bit I2C and SMBus I/O Expander, 1.65 to 5.5 V, -40 to 85 degC, 16-pin QFN (RGT), Green (RoHS & no Sb/Br); Manufacturer: Texas Instruments; Max Frequency(kHz): 400; Low Power: Yes; I2C Address: 0100 00x; # of I/Os: 8; VCC(Max)(V): 5.5; SubFamily: I2C IO Expander; VCC(Min)(V): 1.65; fSCLK(Max)(MHz): 400; ComponentLink2Description: Package Specification; PackageDescription: 16-Pin Plastic Quad Flat No-Lead, 3 x 3 mm Body, 0.5 mm Pitch, 1.45 x 1.45 mm Exposed Pad; Code_JEDEC: MO-220; PackageReference: RGT0016A; Interrupt Output: Yes; PartNumber: TCA6408ARGTR; No. of Outputs: 8; ComponentLink2URL: http://www.ti.com/litv/pdf/mpds361; Push-Pull I/O Type: Yes; Reset Input: Yes; DatasheetVersion: SCPS192C; ComponentLink1Description: Datasheet; Eco-Plan: Green (RoHS & no Sb/Br); 5V Tolerant I/O: Yes; PackageVersion: revH, Oct-2011; Mounting Technology: Surface Mount; Vcc range(V): 1.65 to 5.5; ComponentLink1URL: http://www.ti.com/general/docs/lit/getliterature.tsp?genericPartNumber=TCA6408A&fileType=pdf; Configuration Registers: Yes
U28-U31 = BOS1901CWR: The BOS1901 piezo actuator driver, powered by Boréas' CapDrive™ technology, delivers up to 190 Vpk-pk waveforms with minimal power from a 3 to 5.5 V source, featuring a high-speed SPI for efficient multi-actuator integration. It requires only seven passive components for a streamlined BOM, supports a Unidirectional Power Input to enhance system efficiency, and ensures rapid start-up and fault protection for reliable operation.
X1 = OK252032.768KJBA4SL: Active Crystal Oscillator, Supply current: 5mA, Operating temperature: -40°C to +85°C, Operating voltage: 1.8V to 3.3V, Frequency: 32.768kHz, Frequency stability (full temp): ±20ppm; Manufacturer: YXC(扬兴晶振); Add into BOM: yes; Supply Voltage: 1.8V~3.3V; Symbol: OK252032.768KJBA4SL; Device: OK252032.768KJBA4SL; Supplier: LCSC; Supplier Part: C669098; Manufacturer Part: OK252032.768KJBA4SL; Value: 32.768kHz; JLCPCB Part Class: 扩展库; LCSC Part Name: 32.768kHz ±10ppm 1.8V~3.3V YSO120TK; Supplier Footprint: SMD2520-4P; Datasheet: https://atta.szlcsc.com/upload/public/pdf/source/20210329/C669097_715D097E9D19B4E01936AF746F4B6B69.pdf; Convert to PCB: yes; Supply Current (Max): 5mA; Frequency Stability(Full temperature range): ±20ppm; Operating Temperature: -40℃~+85℃; Name: 32.768kHz